# Altium schematic sheet Sheet1.SchDoc
size A3
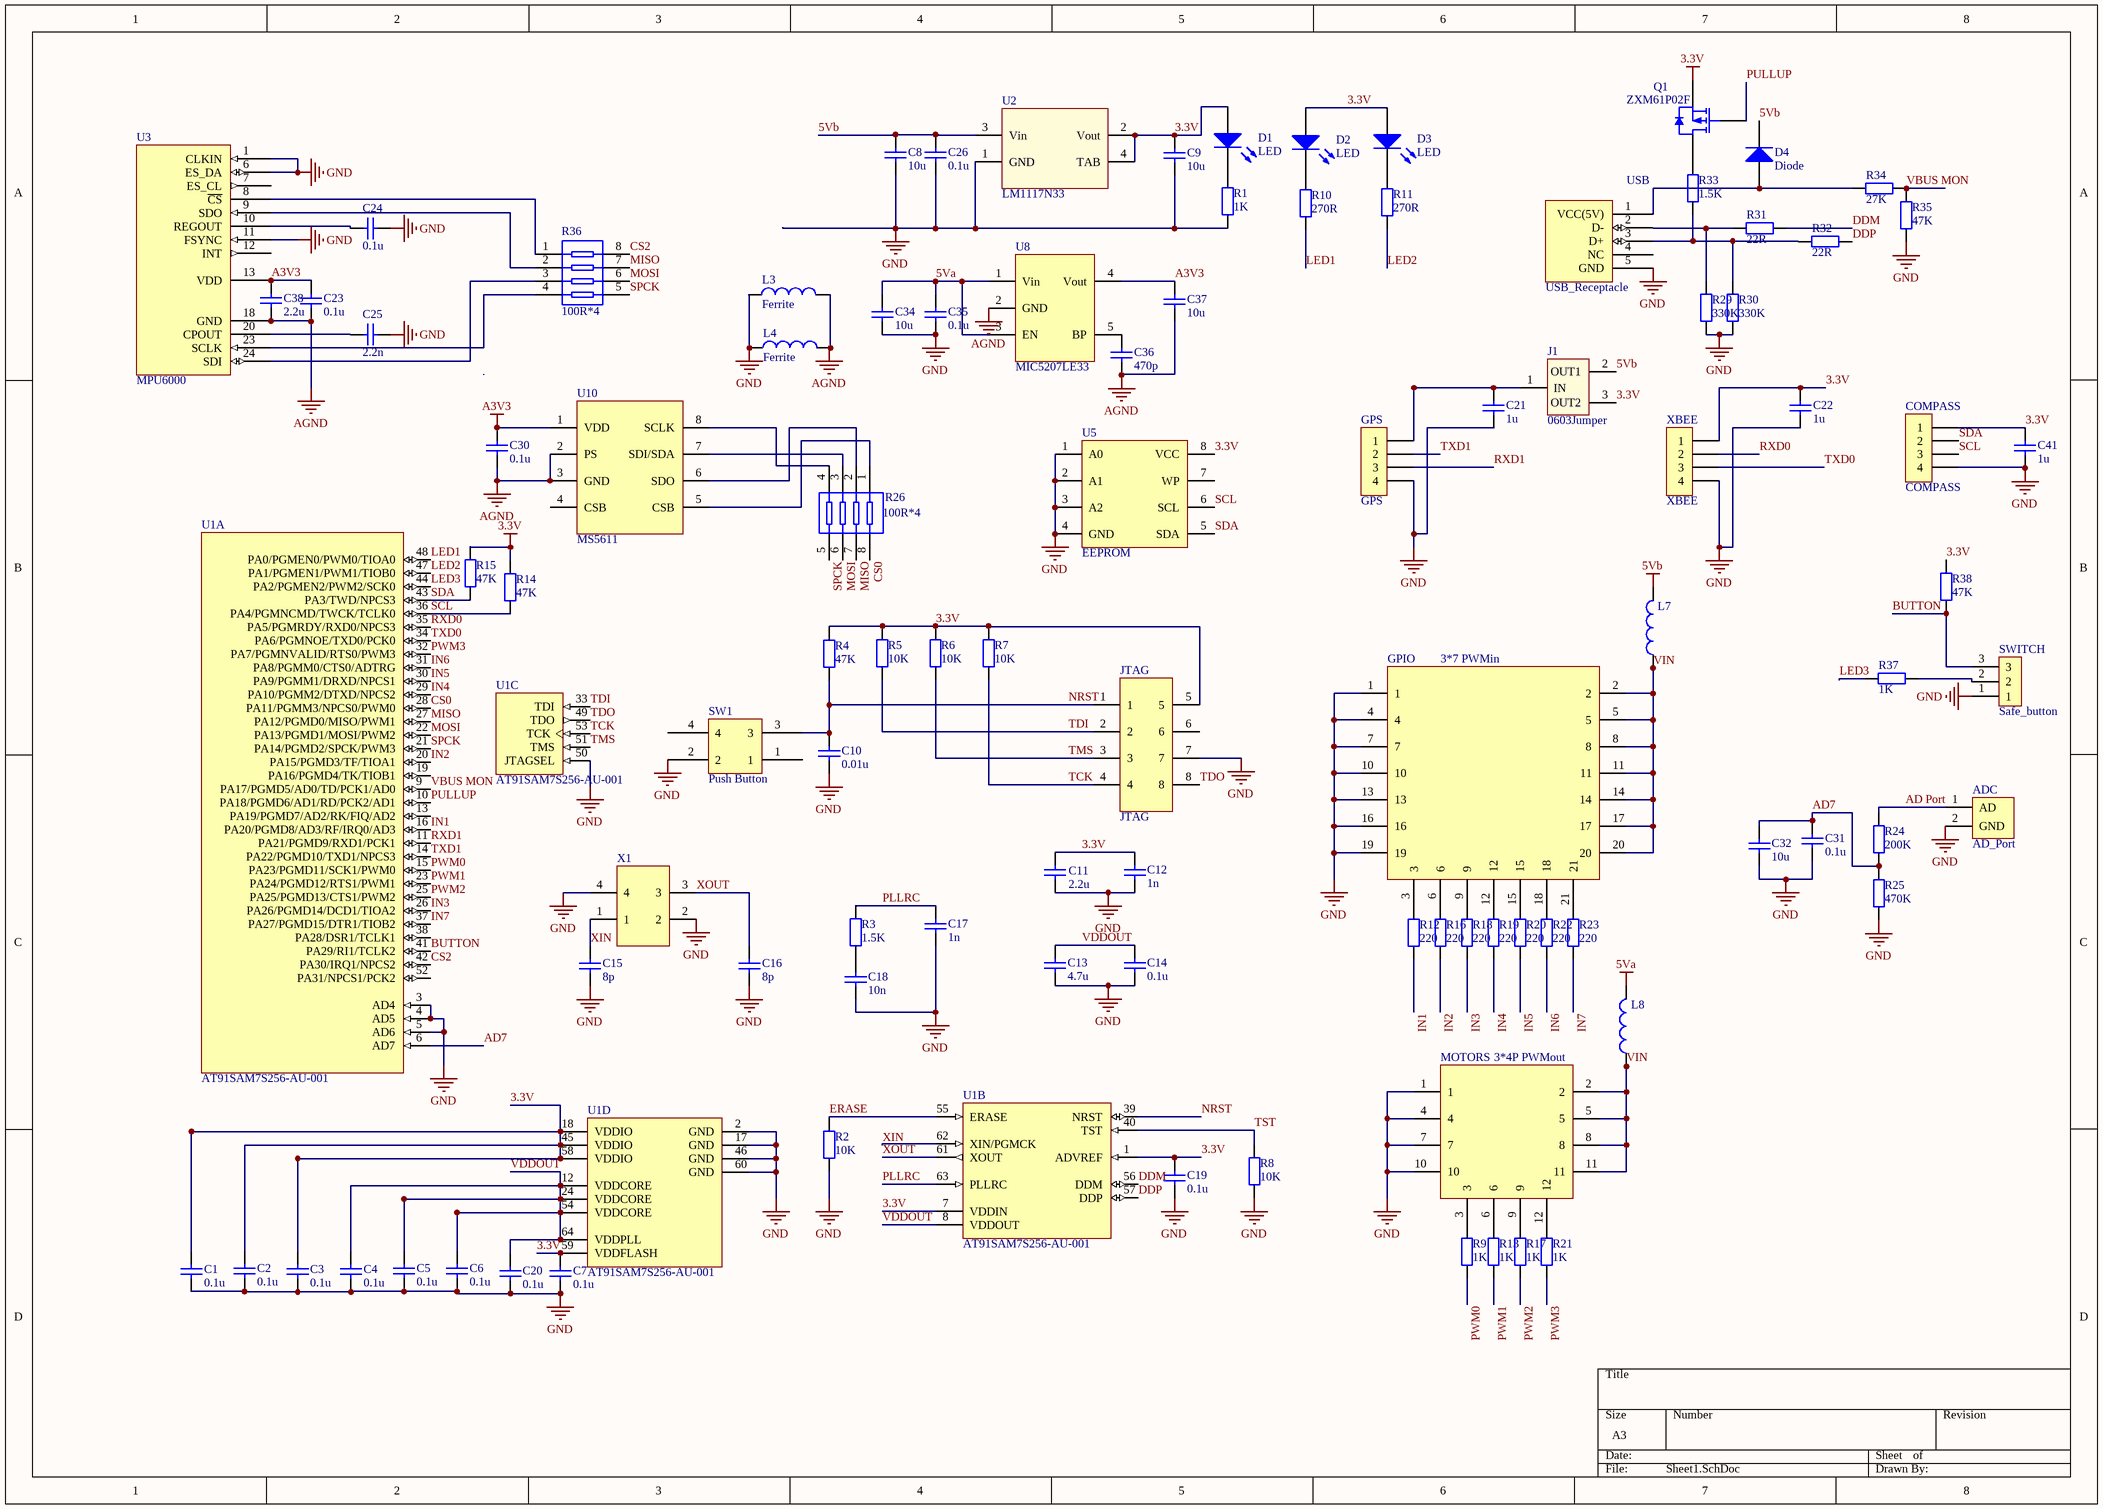
[diagram p0: Sheet1.SchDoc]

## Parts
ADC  AD_Port  [2P_1.25mm（贴片）]
C1  0.1u  [1608[0603]]
C2  0.1u  [1608[0603]]
C3  0.1u  [1608[0603]]
C4  0.1u  [1608[0603]]
C5  0.1u  [1608[0603]]
C6  0.1u  [1608[0603]]
C7  0.1u  [1608[0603]]
C8  10u  [1206]
C9  10u  [1206]
C10  0.01u  [1608[0603]]
C11  2.2u  [0805]
C12  1n  [1608[0603]]
C13  4.7u  [0805]
C14  0.1u  [1608[0603]]
C15  8p  [1608[0603]]
C16  8p  [1608[0603]]
C17  1n  [1608[0603]]
C18  10n  [1608[0603]]
C19  0.1u  [1608[0603]]
C20  0.1u  [1608[0603]]
C21  1u  [1608[0603]]
C22  1u  [1608[0603]]
C23  0.1u  [1608[0603]]
C24  0.1u  [1608[0603]]
C25  2.2n  [1608[0603]]
C26  0.1u  [1608[0603]]
C30  0.1u  [1608[0603]]
C31  0.1u  [1608[0603]]
C32  10u  [1206]
C34  10u  [1206]
C35  0.1u  [1608[0603]]
C36  470p  [1608[0603]]
C37  10u  [1206]
C38  2.2u  [1608[0603]]
C41  1u  [1608[0603]]
COMPASS  COMPASS  [4P_1.25mm（贴片）]
D1  LED  [LED]
D2  LED  [LED]
D3  LED  [LED]
D4  Diode  [1206]
GPIO  3*7 PWMin  [HEADER3X7]
GPS  GPS  [6P_PH1.25mm（贴片）]
J1  0603Jumper  [1-2Jumper]
JTAG  JTAG  [JTAG2]
L3  Ferrite  [1608[0603]]
L4  Ferrite  [1608[0603]]
L7  (no value)  [1608[0603]]
L8  (no value)  [1608[0603]]
MOTORS  3*4P PWMout  [header3x4]
Q1  ZXM61P02F  [SOT23]
R1  1K  [1608[0603]]
R2  10K  [1608[0603]]
R3  1.5K  [1608[0603]]
R4  47K  [1608[0603]]
R5  10K  [1608[0603]]
R6  10K  [1608[0603]]
R7  10K  [1608[0603]]
R8  10K  [1608[0603]]
R9  1K  [1608[0603]]
R10  270R  [1608[0603]]
R11  270R  [1608[0603]]
R12  220  [1608[0603]]
R13  1K  [1608[0603]]
R14  47K  [1608[0603]]
R15  47K  [1608[0603]]
R16  220  [1608[0603]]
R17  1K  [1608[0603]]
R18  220  [1608[0603]]
R19  220  [1608[0603]]
R20  220  [1608[0603]]
R21  1K  [1608[0603]]
R22  220  [1608[0603]]
R23  220  [1608[0603]]
R24  200K  [1608[0603]]
R25  470K  [1608[0603]]
R26  100R*4  [Resistances]
R29  330K  [1608[0603]]
R30  330K  [1608[0603]]
R31  22R  [1608[0603]]
R32  22R  [1608[0603]]
R33  1.5K  [1608[0603]]
R34  27K  [1608[0603]]
R35  47K  [1608[0603]]
R36  100R*4  [ResPack]
R37  1K  [1608[0603]]
R38  47K  [1608[0603]]
SW1  Push Button  [switch]
SWITCH  Safe_button  [3P_1.25mm（贴片）]
U1  AT91SAM7S256-AU-001  [LQFP64_N]  (parts A,B,C,D of 4)
U2  LM1117N33  [SOT230P700X180-4N]
U3  MPU6000  [LGANEW]
U5  EEPROM  [EEPROM]
U8  MIC5207LE33  [S5]
U10  MS5611  [MS_5611]
USB  USB_Receptacle  [micro_usb]
X1  (no value)  [OSC2]
XBEE  XBEE  [4P_1.25mm（贴片）]

## Nets
3.3V: C1.2 C2.2 C3.2 C7.2 C9.2 C11.2 C12.2 C19.2 C22.2 C41.2 COMPASS.1 D1.1(A) D2.1(A) D3.1(A) J1.3(OUT2) JTAG.5 Q1.2(S) R4.2 R5.2 R6.2 R7.2 R14.2 R15.2 R38.2 U1.1(ADVREF) U1.7(VDDIN) U1.18(VDDIO) U1.45(VDDIO) U1.58(VDDIO) U1.59(VDDFLASH) U2.2(Vout) U2.4(NC) U5.8(VCC) XBEE.1
5Va: C34.2 C35.2 L8.2 U8.1(Vin) U8.3(EN)
5Vb: C8.2 C26.2 D4.2(K) J1.2(OUT1) L7.2 U2.3(Vin)
A3V3: C23.2 C30.2 C37.2 C38.2 U3.13(VDD) U8.4(Vout) U10.1(VDD)
AGND: C23.1 C30.1 C36.1 C37.1 C38.1 L3.2 L4.2 U3.18(GND) U8.2(GND) U10.2(PS) U10.3(GND)
GND: ADC.2(GND) C1.1 C2.1 C3.1 C4.1 C5.1 C6.1 C7.1 C8.1 C9.1 C10.1 C11.1 C12.1 C13.1 C14.1 C15.1 C16.1 C17.1 C18.1 C19.1 C20.1 C21.1 C22.1 C24.1 C25.1 C26.1 C31.1 C32.1 C34.1 C35.1 C41.1 COMPASS.4 GPIO.1 GPIO.4 GPIO.7 GPIO.10 GPIO.13 GPIO.16 GPIO.19 GPS.4 JTAG.7 L3.1 L4.1 MOTORS.1 MOTORS.4 MOTORS.7 MOTORS.10 R1.1 R2.1 R8.1 R25.1 R29.2 R30.2 R35.1 SW1.2 SWITCH.1 U1.2(GND) U1.3(AD4) U1.4(AD5) U1.5(AD6) U1.17(GND) U1.46(GND) U1.50(JTAGSEL) U1.60(GND) U2.1(GND) U3.1(CLKIN) U3.6(ES_DA) U3.11(FSYNC) U5.1(A0) U5.2(A1) U5.3(A2) U5.4(GND) USB.5(GND) X1.2 X1.4 XBEE.4
AD7: C31.2 C32.2 R24.1 R25.2 U1.6(AD7)
AD Port: ADC.1(AD) R24.2
BUTTON: R38.1 SWITCH.3 U1.41(PA29/RI1/TCLK2)
CS0: R26.8 U1.28(PA11/PGMM3/NPCS0/PWM0)
CS2: R36.8 U1.42(PA30/IRQ1/NPCS2)
DDM: R31.2 U1.56(DDM)
DDP: R32.2 U1.57(DDP)
ERASE: R2.2 U1.55(ERASE)
IN1: R12.1 U1.16(PA20/PGMD8/AD3/RF/IRQ0/AD3)
IN2: R16.1 U1.20(PA15/PGMD3/TF/TIOA1)
IN3: R18.1 U1.26(PA26/PGMD14/DCD1/TIOA2)
IN4: R19.1 U1.29(PA10/PGMM2/DTXD/NPCS2)
IN5: R20.1 U1.30(PA9/PGMM1/DRXD/NPCS1)
IN6: R22.1 U1.31(PA8/PGMM0/CTS0/ADTRG)
IN7: R23.1 U1.37(PA27/PGMD15/DTR1/TIOB2)
LED1: R10.1 U1.48(PA0/PGMEN0/PWM0/TIOA0)
LED2: R11.1 U1.47(PA1/PGMEN1/PWM1/TIOB0)
LED3: R37.2 U1.44(PA2/PGMEN2/PWM2/SCK0)
MISO: R26.7 R36.7 U1.27(PA12/PGMD0/MISO/PWM1)
MOSI: R26.6 R36.6 U1.22(PA13/PGMD1/MOSI/PWM2)
NRST: C10.2 JTAG.1 R4.1 SW1.3 U1.39(NRST)
PLLRC: C17.2 R3.2 U1.63(PLLRC)
PULLUP: Q1.3(G) U1.10(PA18/PGMD6/AD1/RD/PCK2/AD1)
PWM0: R9.1 U1.15(PA23/PGMD11/SCK1/PWM0)
PWM1: R13.1 U1.23(PA24/PGMD12/RTS1/PWM1)
PWM2: R17.1 U1.25(PA25/PGMD13/CTS1/PWM2)
PWM3: R21.1 U1.32(PA7/PGMNVALID/RTS0/PWM3)
RXD0: U1.35(PA5/PGMRDY/RXD0/NPCS3) XBEE.2
RXD1: GPS.3 U1.11(PA21/PGMD9/RXD1/PCK1)
SCL: COMPASS.3 R14.1 U1.36(PA4/PGMNCMD/TWCK/TCLK0) U5.6(SCL)
SDA: COMPASS.2 R15.1 U1.43(PA3/TWD/NPCS3) U5.5(SDA)
SPCK: R26.5 R36.5 U1.21(PA14/PGMD2/SPCK/PWM3)
TCK: JTAG.4 R7.1 U1.53(TCK)
TDI: JTAG.2 R5.1 U1.33(TDI)
TDO: JTAG.8 U1.49(TDO)
TMS: JTAG.3 R6.1 U1.51(TMS)
TST: R8.2 U1.40(TST)
TXD0: U1.34(PA6/PGMNOE/TXD0/PCK0) XBEE.3
TXD1: GPS.2 U1.14(PA22/PGMD10/TXD1/NPCS3)
VBUS MON: R34.2 R35.2 U1.9(PA17/PGMD5/AD0/TD/PCK1/AD0)
VDDOUT: C4.2 C5.2 C6.2 C13.2 C14.2 C20.2 U1.8(VDDOUT) U1.12(VDDCORE) U1.24(VDDCORE) U1.54(VDDCORE) U1.64(VDDPLL)
VIN: GPIO.2 GPIO.5 GPIO.8 GPIO.11 GPIO.14 GPIO.17 GPIO.20 L7.1 L8.1 MOTORS.2 MOTORS.5 MOTORS.8 MOTORS.11
XIN: C15.2 U1.62(XIN/PGMCK) X1.1
XOUT: C16.2 U1.61(XOUT) X1.3
NetC18_2: C18.2 R3.1
NetC21_2: C21.2 GPS.1 J1.1(IN)
NetC24_2: C24.2 U3.10(REGOUT)
NetC25_2: C25.2 U3.20(CPOUT)
NetC36_2: C36.2 U8.5(BP)
NetD1_2: D1.2(K) R1.2
NetD2_2: D2.2(K) R10.2
NetD3_2: D3.2(K) R11.2
NetD4_1: D4.1(A) R34.1 USB.1(VCC(5V))
NetGPIO_3: GPIO.3 R12.2
NetGPIO_6: GPIO.6 R16.2
NetGPIO_9: GPIO.9 R18.2
NetGPIO_12: GPIO.12 R19.2
NetGPIO_15: GPIO.15 R20.2
NetGPIO_18: GPIO.18 R22.2
NetGPIO_21: GPIO.21 R23.2
NetMOTORS_3: MOTORS.3 R9.2
NetMOTORS_6: MOTORS.6 R13.2
NetMOTORS_9: MOTORS.9 R17.2
NetMOTORS_12: MOTORS.12 R21.2
NetQ1_1: Q1.1(D) R33.1
NetR26_1: R26.1 U10.5(CSB)
NetR26_2: R26.2 U10.6(SDO)
NetR26_3: R26.3 U10.7(SDI/SDA)
NetR26_4: R26.4 U10.8(SCLK)
NetR29_1: R29.1 R31.1 USB.2(D-)
NetR30_1: R30.1 R32.1 R33.2 USB.3(D+)
NetR36_1: R36.1 U3.8(~{CS})
NetR36_2: R36.2 U3.9(SDO)
NetR36_3: R36.3 U3.24(SDI)
NetR36_4: R36.4 U3.23(SCLK)
NetR37_1: R37.1 SWITCH.2

Not connected (* = marked no-connect by the designer): JTAG 6; SW1 1 4; U1 13(PA19/PGMD7/AD2/RK/FIQ/AD2) 19(PA16/PGMD4/TK/TIOB1) 38(PA28/DSR1/TCLK1) 52(PA31/NPCS1/PCK2); U3 2(NC) 4(NC) 5(NC) 7(ES_CL) 12(INT) 14(NC) 16(NC) 19(NC) 21(NC) 22(NC); U5 7(WP); U10 4(CSB); USB 4(NC)

## Library data of the parts
C1-C7 C10 C12 C14-C25 C30 C31 C35-C38 C41 = Cap 0603: 0603 Capacitor; Published: 8-Jun-2000; LatestRevisionDate: 17-Jul-2002; LatestRevisionNote: Re-released for DXP Platform.; PackageReference: RAD-0.3; Publisher: Altium Limited; PackageDescription: Radial Cap, Thru-Hole; 2 Leads; 0.3 in Pin Spacing
C8 C9 C26 C32 C34 = Cap 1206: 1206 Capacitor; Published: 8-Jun-2000; LatestRevisionDate: 17-Jul-2002; LatestRevisionNote: Re-released for DXP Platform.; PackageReference: RAD-0.3; Publisher: Altium Limited; PackageDescription: Radial Cap, Thru-Hole; 2 Leads; 0.3 in Pin Spacing
C11 C13 = Cap 0805: 0805 Capacitor; Published: 8-Jun-2000; LatestRevisionDate: 17-Jul-2002; LatestRevisionNote: Re-released for DXP Platform.; PackageReference: RAD-0.3; Publisher: Altium Limited; PackageDescription: Radial Cap, Thru-Hole; 2 Leads; 0.3 in Pin Spacing
COMPASS = COMPASS: Header, 4-Pin; LatestRevisionDate: 17-Jul-2002; LatestRevisionNote: Re-released for DXP Platform.; Publisher: Altium Limited
D1-D3 = LED: Typical RED, GREEN, YELLOW, AMBER GaAs LED; Published: 8-Jun-2000; LatestRevisionDate: 17-Jul-2002; LatestRevisionNote: Re-released for DXP Platform.; PackageVersion: Feb-2002; PackageReference: 3.2X1.6X1.1; Publisher: Altium Limited; PackageDescription: SM LED; 2 Flat Leads
D4 = Diode: Default Diode; Published: 8-Jun-2000; LatestRevisionDate: 17-Jul-2002; LatestRevisionNote: Re-released for DXP Platform.; PackageVersion: Sep-1996; PackageReference: SMC; Publisher: Altium Limited; PackageDescription: DO-214-AB/SMC; 2 C-Bend Leads; Body 7.9 x 5.9 mm, inc. leads (LxW); Code_JEDEC: DO-214-AB
GPIO = MyPWMin
GPS = GPS: Header, 4-Pin; LatestRevisionDate: 17-Jul-2002; LatestRevisionNote: Re-released for DXP Platform.; Publisher: Altium Limited
JTAG = JTAG2
L3 L4 L7 L8 = Inductor: Code_IEC: 1005; Published: 8-Jun-2000; LatestRevisionDate: 29-May-2009; LatestRevisionNote: IPC-7351 Footprint Added.; PackageReference: 0402-A; Publisher: Altium Limited; PackageDescription: Chip Inductor; Code_JEITA: 0402
MOTORS = MyPWMout
Q1 = ZXM61P02F: 20V P-Channel Enhancement Mode MOSFET; Published: 17-Dec-2003; DatasheetVersion: Jul-99; PackageVersion: 1996; PackageReference: SOT23; Publisher: Altium Limited; PackageDescription: SOT-23; 3 Leads; Body 3.1 x 2.5 mm, inc. leads (LxW max), Alternate Lead Configuration; ComponentLink1Description: Manufacturer Link; ComponentLink1URL: http://www.zetex.com/; ComponentLink2Description: Datasheet; ComponentLink2URL: www.zetex.com/3.0/pdf/ZXM61P02F.pdf
R1-R25 R29-R35 R37 R38 = Res 0603: Resistor
  R1-R8 R10-R12 R14-R16 R18-R20 R22-R25 R29-R35 R37 R38: Published: 8-Jun-2000; LatestRevisionDate: 17-Jul-2002; LatestRevisionNote: Re-released for DXP Platform.; PackageReference: AXIAL-0.4; Publisher: Altium Limited; PackageDescription: Axial Device, Thru-Hole; 2 Leads; 0.4 in Pin Spacing
R26 R36 = Res Pack4: Isolated Resistor Network; Value: 100R; Published: 24-Mar-1999; LatestRevisionDate: 29-May-2009; LatestRevisionNote: IPC-7351 Footprint Added.; PackageVersion: Oct-2003; PackageReference: SSOP16; Publisher: Altium Limited; PackageDescription: 16-Pin Plastic Small Outline Package 0.65 mm Pitch; Code_JEDEC: MO-150-AC; Code_IPC: SOP65P780-16
U1 = AT91SAM7S256-AU-001: AT91 ARM Thumb-based 32-bit Microcontroller, 256KB Flash, 64KB SRAM, 64-Pin LQFP, 11-ch. PDC, Industrial Grade (-40癈 to 85癈), Pb-Free; Published: 16-Oct-2006; DatasheetVersion: revJ, Dec-2009; PackageVersion: Apr-2006; PackageReference: LQFP64; Publisher: Altium Limited; PackageDescription: 64-Pin Thin Quad Flat Pack 0.5 mm Pitch; Supplier 1: Digi-Key; Supplier Part Number 1: AT91SAM7S256AU001-ND; Supplier 2: Farnell; Supplier Part Number 2: 1095460; Supplier 3: Farnell; Supplier Part Number 3: 1528287; Supplier 4: Mouser; Supplier Part Number 4: 556-A91SAM7S256AU001; Code_JEDEC: MS-026-BCD; ComponentLink1Description: Manufacturer Link; ComponentLink1URL: http://www.atmel.com/products/AT91/default.asp?; ComponentLink2Description: AT91SAM7S Series Datasheet; ComponentLink2URL: http://www.atmel.com/dyn/resources/prod_documents/doc6175.pdf; ComponentLink3Description: AT91SAM7S Series Summary; ComponentLink3URL: http://www.atmel.com/dyn/resources/prod_documents/6175s.pdf; ComponentLink4Description: ARM7TDMI Reference Manual; ComponentLink4URL: http://www.atmel.com/dyn/resources/prod_documents/DDI0029G_7TDMI_R3_trm.pdf; ComponentLink5Description: Atmel.com Home; ComponentLink5URL: http://www.atmel.com
U2 = LM1117S33: 3.3V Regulator
U5 = ROM
U8 = MIC5207
X1 = OSC2
XBEE = XBEE: Header, 4-Pin; LatestRevisionDate: 17-Jul-2002; LatestRevisionNote: Re-released for DXP Platform.; Publisher: Altium Limited